# Altium project Circuit.PrjPcb
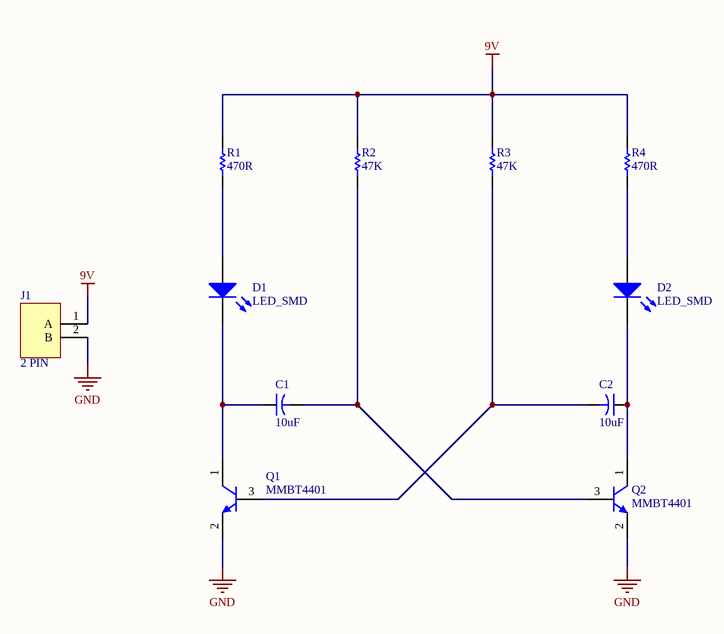
[diagram p0: Circuit.SchDoc]
1 sheet, 11 parts. Net scope: global (net labels, ports and power ports of the same name join across sheets).
Board file: Circuit.PcbDoc

## Sheet Circuit.SchDoc
size A4; SheetNumber: 1; SheetTotal: 1

### Parts
C1  value 10uF  [CAPR5-4X5]  (hidden comment: Cap2)
C2  value 10uF  [CAPR5-4X5]  (hidden comment: Cap2)
D1  LED_SMD  [0603_LED]
D2  LED_SMD  [0603_LED]
J1  2 PIN  [JST_2_PIN]
Q1  MMBT4401  [SOT23_N]
Q2  MMBT4401  [SOT23_N]
R1  value 470R  [R0603]  (hidden comment: Res1)
R2  value 47K  [R0603]  (hidden comment: Res1)
R3  value 47K  [R0603]  (hidden comment: Res1)
R4  value 470R  [R0603]  (hidden comment: Res1)

### Nets
9V: J1.1(A) R1.1 R2.1 R3.1 R4.1
GND: J1.2(B) Q1.2(E) Q2.2(E)
NetC1_1: C1.1 D1.2(K) Q1.1(C)
NetC1_2: C1.2 Q2.3(B) R2.2
NetC2_1: C2.1 D2.2(K) Q2.1(C)
NetC2_2: C2.2 Q1.3(B) R3.2
NetD1_1: D1.1(A) R1.2
NetD2_1: D2.1(A) R4.2

### Library data of the parts
C1 C2 = Cap2: Capacitor; PackageReference: CAPR5-4X5; PackageDescription: Capacitor; 2 Leads
D1 D2 = LED_SMD: LED RED CLEAR 0603 SMD; Manufacturer Part Number: LTST-C191KRKT; PackageReference: 0603 (1608 Metric); PackageDescription: 1.60mm L x 0.80mm W; Digikey Part Number: 160-1447-1-ND; Value: RED
J1 = Connector_2Pin
Q1 Q2 = NPN: NPN Bipolar Transistor; Manufacturer: ON Semiconductor; Manufacturer Part Number: MMBT4401LT1G; PackageReference: SOT-23-3 (TO-236); PackageDescription: SOT-23-3 (TO-236); Digikey Part Number: MMBT4401LT1GOSCT-ND; Value: MMBT4401
R1-R4 = Res1: Resistor; PackageReference: AXIAL-0.3; PackageDescription: Axial Device, Thru-Hole; 2 Leads; 0.3 in Pin Spacing